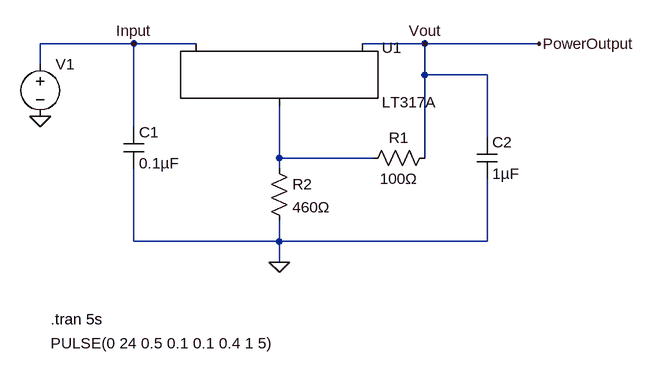
[diagram p0: schematic inputCircuit.asc]
inputCircuit.asc, the LTspice schematic file:
Version 4
SHEET 1 880 680
WIRE 32 80 -112 80
WIRE 128 80 32 80
WIRE 480 80 384 80
WIRE 656 80 480 80
WIRE -112 112 -112 80
WIRE 480 128 480 80
WIRE 576 128 480 128
WIRE 32 208 32 80
WIRE 576 224 576 128
WIRE 256 256 256 176
WIRE 400 256 256 256
WIRE 480 256 480 128
WIRE 256 272 256 256
WIRE 32 384 32 272
WIRE 256 384 256 352
WIRE 256 384 32 384
WIRE 576 384 576 288
WIRE 576 384 256 384
WIRE 256 416 256 384
FLAG -112 192 0
FLAG 256 416 0
FLAG 656 80 PowerOutput
FLAG 32 80 Input
FLAG 480 80 Vout
SYMBOL PowerProducts\\LT317A 256 80 R0
SYMATTR InstName U1
SYMBOL voltage -112 96 R0
WINDOW 123 0 0 Left 0
WINDOW 39 0 0 Left 0
WINDOW 3 16 445 Left 2
SYMATTR Value PULSE(0 24 0.5 0.1 0.1 0.4 1 5)
SYMATTR InstName V1
SYMBOL cap 16 208 R0
SYMATTR InstName C1
SYMATTR Value 0.1µF
SYMBOL res 240 256 R0
SYMATTR InstName R2
SYMATTR Value 460Ω
SYMBOL res 496 240 R90
WINDOW 0 0 56 VBottom 2
WINDOW 3 32 56 VTop 2
SYMATTR InstName R1
SYMATTR Value 100Ω
SYMBOL cap 560 224 R0
SYMATTR InstName C2
SYMATTR Value 1µF
TEXT -96 504 Left 2 !.tran 5s

The netlist it stands for:
* inputCircuit.asc
XU1 N001 Vout Input LT317A
V1 Input 0 PULSE(0 24 0.5 0.1 0.1 0.4 1 5)
C1 Input 0 0.1µF
R2 N001 0 460Ω
R1 Vout N001 100Ω
C2 Vout 0 1µF
.tran 5s
.lib LTC.lib
.backanno
.end